# EAGLE design blinkm_mk2l (EAGLE 6.5.0)
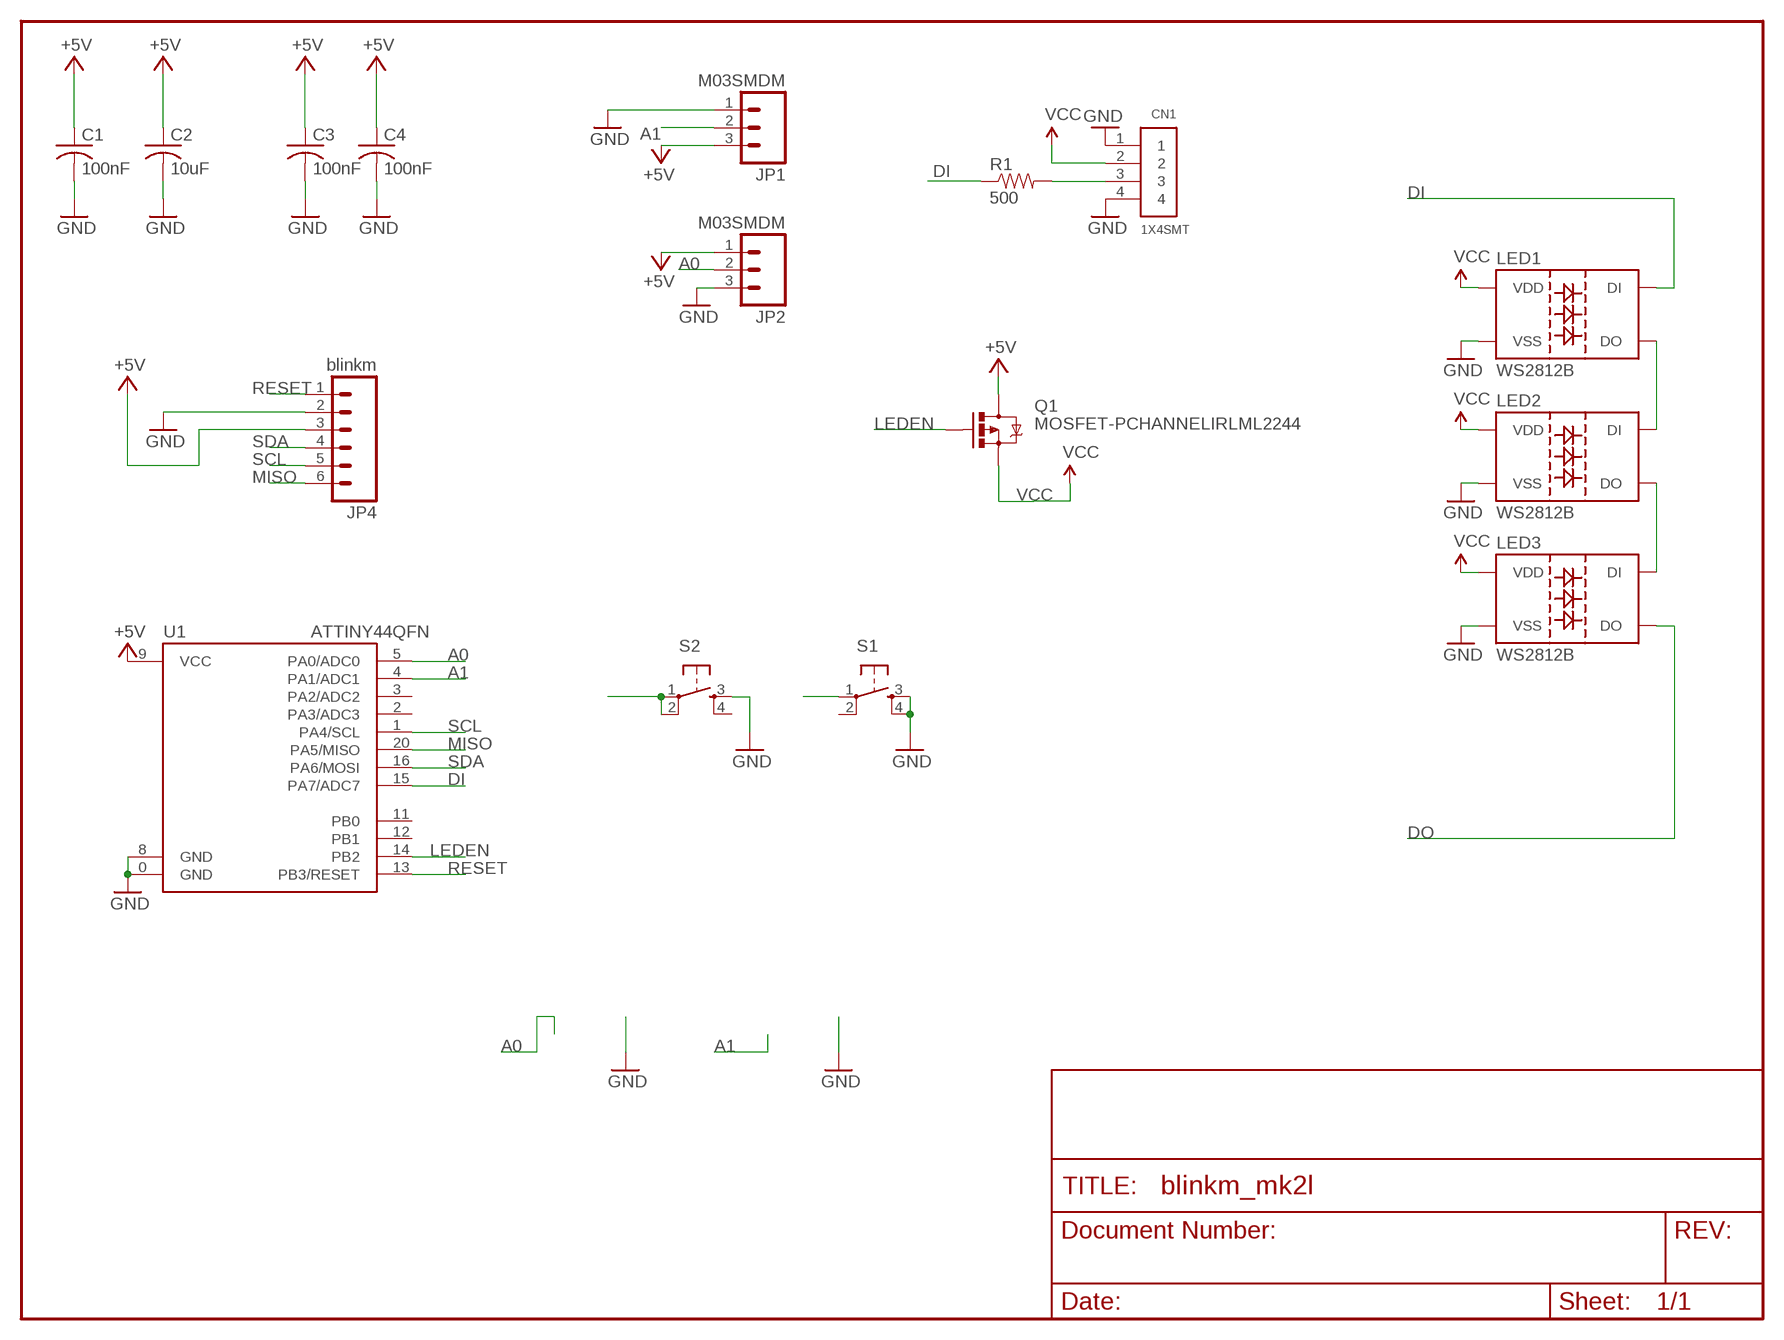
[diagram p0: schematic, sheet 1]

## Parts
C1  100nF  C-USC0603  [C0603]
C2  10uF  C-USC0603  [C0603]
C3  100nF  C-USC0603  [C0603]
C4  100nF  C-USC0603  [C0603]
CN1  1X4SMT  [1X4-SMT]
JP1  M03SMDM  [1X03-SMD-MINIMAL]
JP2  M03SMDM  [1X03-SMD-MINIMAL]
JP4  blinkm  M06LOCK  [1X06_LOCK]
LED1  WS2812B  [WS2812B]
LED2  WS2812B  [WS2812B]
LED3  WS2812B  [WS2812B]
Q1  MOSFET-PCHANNELIRLML2244  [SOT23-3]
R1  500  RESISTOR0603  [0603-RES]
S1  TAC_SWITCHSMD  [TACTILE_SWITCH_SMD]
S2  TAC_SWITCHSMD  [TACTILE_SWITCH_SMD]
U1  ATTINY44QFN  ATTINY24QFN  [QFN20]

## Nets
+5V: C1.1 C2.1 C3.1 C4.1 JP1.3 JP2.1 JP4.3 Q1.3(D) U1.9(VCC)
A0: JP2.2 S2.1 S2.2 U1.5(PA0/ADC0)
A1: JP1.2 S1.1 U1.4(PA1/ADC1)
DI: LED1.4(DI) R1.1 U1.15(PA7/ADC7)
DO: LED3.2(DO)
DOI1: LED1.2(DO) LED2.4(DI)
DOI2: LED2.2(DO) LED3.4(DI)
GND: C1.2 C2.2 C3.2 C4.2 CN1.1 CN1.4 JP1.1 JP2.3 JP4.2 LED1.3(VSS) LED2.3(VSS) LED3.3(VSS) S1.3 S1.4 S2.3 U1.0(GND) U1.8(GND)
LEDEN: Q1.1(G) U1.14(PB2)
MISO: JP4.6 U1.20(PA5/MISO)
N$1: CN1.3 R1.2
RESET: JP4.1 U1.13(PB3/RESET)
SCL: JP4.5 U1.1(PA4/SCL)
SDA: JP4.4 U1.16(PA6/MOSI)
VCC: CN1.2 LED1.1(VDD) LED2.1(VDD) LED3.1(VDD) Q1.2(S)
Unconnected: S1.2 S2.4 U1.2(PA3/ADC3) U1.3(PA2/ADC2) U1.11(PB0) U1.12(PB1)

## Library data of the parts
C1-C4 = rcl:C-US: CAPACITOR, American symbol
CN1 = adafruit:1X4: 4-pin connector
JP1 JP2 = todstuff:M03
JP4 = SparkFun-Connectors:M06: Header 6 Standard 6-pin 0.1" header. Use with straight break away headers (SKU : PRT-00116), right angle break away headers (PRT-00553), swiss pins (PRT-00743), machine pins (PRT-00117), and female headers (PRT-00115). Molex polarized connector foot print use with SKU : PRT-08094 with associated crimp pins and housings. NOTES ON THE VARIANTS LOCK and LOCK_LONGPADS... This footprint was designed to help hold the alignment of a through-hole component (i.e. 6-pin header) while soldering it into place. You may notice that each hole has been shifted either up or down by 0.005 of an inch from it's more standard position (which is a perfectly straight line). This slight alteration caused the pins (the squares in the middle) to touch the edges of the holes. Because they are alternating, it causes a "brace" to hold the component in place. 0.005 has proven to be the perfect amount of "off-center" position when using our standard breakaway headers. Although looks a little odd when you look at the bare footprint, once you have a header in there, the alteration is very hard to notice. Also, if you push a header all the way into place, it is covered up entirely on the bottom side. This idea of altering the position of holes to aid alignment will be further integrated into the Sparkfun Library for other footprints. It can help hold any component with 3 or more connection pins.
LED1-LED3 = WS2812:WS2812B
Q1 = SparkFun-DiscreteSemi:MOSFET-PCHANNEL: Generic PMOSFET; PROD_ID: TRANS-11153
R1 = SparkFun-Resistors:RESISTOR: Resistor Basic schematic elements and footprints for 0603, 1206, and PTH resistors.
S1 S2 = SparkFun-Electromechanical:TAC_SWITCH: Momentary Switch Button commonly used for reset or general input. Spark Fun Electronics SKU : COM-00097 SMT- SWCH-08247; PROD_ID: SWCH-08247
U1 = SparkFun-DigitalIC:ATTINY24: Atmel 20-pin 2kB flash uC

## Board
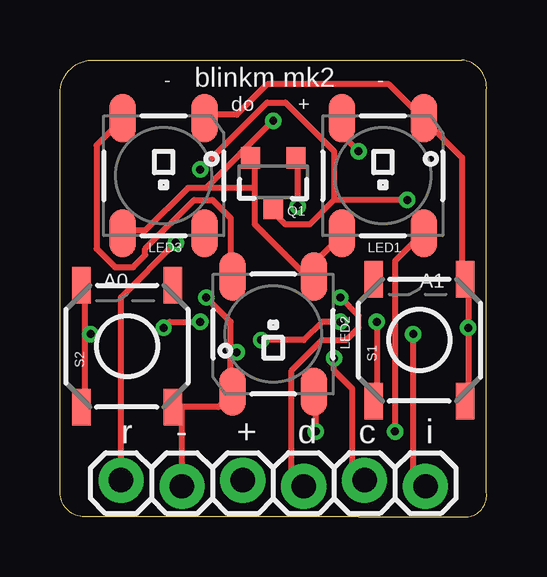
[diagram p1: board, top side]
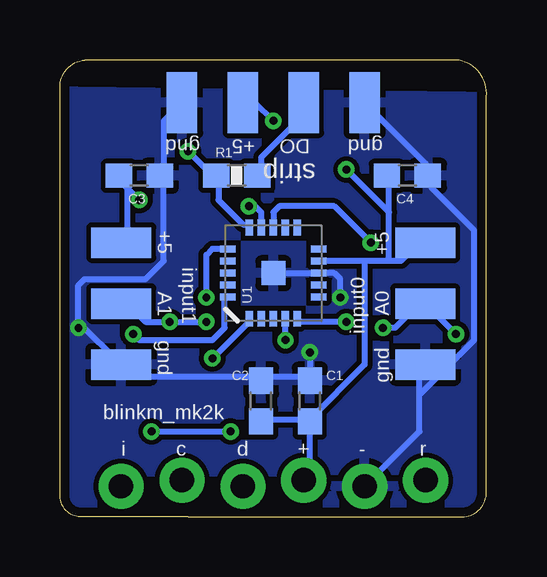
[diagram p2: board, bottom side, seen from below]

Size 17.79 x 19.05 mm. Coordinates in mm from the lower left corner, seen from the top.
Outline: 12.45,0 1.02,0 arc-90 0.01,1.02 0.01,17.53 arc-90 1.28,19.05 16.77,19.05 arc-90 17.79,17.78 17.79,1.02 arc-90 17.02,0 12.45,0
Copper layers (1*16): Top 0.0356mm / dielectric 1.5011mm / Bottom 0.0356mm
Design rules "LaenPCBOrder-tod *": minimum track width 10mil, minimum drill 13mil, track to track 8mil, track to pad 8mil, pad to pad 8mil, via to via 8mil, smd to smd 6mil, copper to edge 15mil, drill to drill 8mil, minimum pad ring 7mil, minimum via ring 7mil, stop-mask expansion 4mil, vias tented up to drill 25mil, thermal gap 10mil
vRestrict: area 7.9,9.1 to 9.9,11.2

### Footprints (pad centres in the part's own frame; a part is rotated, then mirrored left to right if it is on the bottom)
C0603 = smd 1.1 x 1: 1 -0.85,0; 2 0.85,0
1X4-SMT = smd 1.27 x 2.54: 1 -3.81,0; 2 -1.27,0; 3 1.27,0; 4 3.81,0
1X03-SMD-MINIMAL = smd 1.27 x 2.5: 1 -2.54,-0.01; 2 0,-0.01; 3 2.54,-0.01
1X06_LOCK = drill 1.016 pad 1.88: 1 0,0; 2 2.54,-0.254; 3 5.08,0; 4 7.62,-0.254; 5 10.16,0; 6 12.7,-0.254
WS2812B = smd 2 x 1.1: 1 2.4,-1.7; 2 2.4,1.7; 3 -2.4,1.7; 4 -2.4,-1.7
SOT23-3 = smd 0.8 x 0.9: 1 -0.95,-1; 2 0.95,-1; 3 0,1.1
0603-RES = smd 1.1 x 1: 1 -0.85,0; 2 0.85,0
TACTILE_SWITCH_SMD = smd 1.524 x 0.762: 1 -2.54,1.905; 2 2.54,1.905; 3 -2.54,-1.905; 4 2.54,-1.905
QFN20 = smd 1 x 1: 0 0,0 | smd 0.65 x 0.3: 1 -1.9,1; 2 -1.9,0.5; 3 -1.9,0; 4 -1.9,-0.5; 5 -1.9,-1; 11 1.9,-1; 12 1.9,-0.5; 13 1.9,0; 14 1.9,0.5; 15 1.9,1 | smd 0.3 x 0.65: 6 -1,-1.9; 7 -0.5,-1.9; 8 0,-1.9; 9 0.5,-1.9; 10 1,-1.9; 16 1,1.9; 17 0.5,1.9; 18 0,1.9; 19 -0.5,1.9; 20 -1,1.9

### Placement (x,y rotation side)
C1  7.37,4.83 90 bottom
C2  9.4,4.83 90 bottom
C3  14.48,14.22 0 bottom
C4  3.31,14.22 0 bottom
CN1  8.9,17.27 0 bottom
JP1  15.25,8.89 90 bottom
JP2  2.55,8.89 270 bottom
JP4  2.55,1.52 0 top
LED1  13.47,14.22 270 top
LED2  8.9,7.62 90 top
LED3  4.32,14.22 270 top
Q1  8.9,13.97 180 top
R1  10.42,14.22 0 bottom
S1  14.99,7.37 90 top
S2  2.8,7.11 90 top
U1  8.9,10.16 90 bottom

### Tracks (layer width: path | path; a pad name or v marks a point on that pad's centre or on a via)
+5V  (via drill 0.33)
  Top 0.254: 11.44,13.21 10.42,12.19 9.4,12.19 8.9,12.7 Q1.3 | v14.48,13.21 11.44,13.21 | 11.44,13.21 11.44,15.24 9.4,17.27 8.64,17.27 v5.85,14.48
  Bottom 0.254: 14.99,13.72 15.5,14.22 C3.1 | 14.99,13.72 v14.48,13.21 | 14.99,13.72 14.99,11.43 JP1.3 | 7.37,4.06 9.4,4.06 C2.1 | 7.37,4.06 C1.1 | JP4.3 7.37,1.78 7.37,3.81 C1.1 | 4.07,10.67 3.56,10.67 2.8,11.43 JP2.1 | 4.07,10.67 5.09,10.67 | 5.09,10.67 6.86,10.67 U1.9 | 4.07,10.67 4.07,12.7 | 4.07,12.7 4.07,14.22 C4.1 | 7.37,4.06 5.09,6.35 5.09,10.67 | 7.37,4.06 C1.1 | 4.07,12.7 v5.85,14.48
  pour Top: 23.12,18.03 23.12,-2.29 21.34,0 21.34,20.32
A0  (via drill 0.33)
  Top 0.254: 1.02,7.62 1.02,9.65 S2.2 | 1.02,7.62 1.02,4.57 S2.1 | v5.85,8.13 4.58,8.13 v4.32,7.87 | v1.28,7.62 1.02,7.62
  Bottom 0.254: v5.85,8.13 7.88,8.13 U1.5 | v4.32,7.87 3.82,7.87 2.8,8.89 JP2.2 v1.28,7.62
A1  (via drill 0.33)
  Top 0.254: v8.39,7.37 10.17,7.37 10.93,8.13 v11.69,8.13 | v13.21,8.13 13.21,4.83 S1.1
  Bottom 0.254: v8.39,7.37 8.39,8.13 U1.4 | v11.69,8.13 v13.21,8.13 14.23,8.13 14.99,8.89 JP1.2
DI  (via drill 0.33)
  Top 0.254: v12.45,15.24 11.94,15.75 11.94,16.51 LED1.4
  Bottom 0.254: U1.15 9.91,12.19 10.17,12.19 11.18,13.21 11.18,14.22 R1.1 11.44,14.22 v12.45,15.24
DOI1  (via drill 0.33)
  Top 0.254: v10.67,3.56 10.67,5.08 LED2.4 | v13.98,3.56 13.98,10.67 14.99,11.68 LED1.2
  Bottom 0.254: v13.98,3.56 v10.67,3.56
DOI2
  Top 0.254: LED2.2 7.12,10.16 7.12,12.45 6.36,13.21 5.59,13.21 3.56,11.18 3.56,10.92 3.05,10.41 2.29,10.41 1.53,11.18 1.53,15.49 2.55,16.51 LED3.4
GND  (via drill 0.33)
  Top 0.254: S1.3 17.02,4.83 v17.02,7.87 17.02,9.91 S1.4 16.77,9.91 16.77,14.99 15.25,16.51 LED1.3 14.99,16.76 13.72,18.03 8.64,18.03 7.37,16.76 6.1,16.76 LED3.3 | 5.09,4.57 6.61,4.57 7.12,5.08 LED2.3 7.12,5.33 7.12,6.86 | 5.09,4.57 4.83,4.57 S2.3 | v6.1,9.14 7.12,8.13 7.12,6.86 | JP4.2 5.09,4.57 | 7.12,6.86 v7.37,6.86
  Bottom 0.254: 13.47,14.22 13.47,16.51 CN1.1 | 13.47,14.22 C3.2 13.47,14.22 | 9.4,5.84 7.37,5.84 | 7.37,5.84 C1.2 7.37,5.84 | 9.4,5.84 C2.2 9.4,5.84 | 9.4,5.84 14.48,5.84 14.99,6.35 JP1.1 15.25,6.35 17.02,8.13 | 13.47,14.22 13.47,10.67 14.23,9.91 16.77,9.91 17.02,9.65 17.02,8.13 | v17.02,7.87 17.02,8.13 | U1.0 7.12,10.16 U1.8 6.86,10.16 6.36,10.16 6.1,9.91 v6.1,9.14 | CN1.4 2.55,14.73 2.55,14.22 C4.2 2.29,14.22 2.29,13.72 0.51,11.94 0.51,7.37 2.8,5.08 | 2.8,5.08 2.8,3.56 JP4.2 | 2.8,5.08 2.8,6.35 JP2.3 | v7.37,6.86 7.37,5.84
  pour Bottom: -0.76,17.53 -0.76,-1.27 20.33,-1.27 20.33,17.78
LEDEN  (via drill 0.33)
  Top 0.254: v9.91,12.95 9.91,14.73 Q1.1
  Bottom 0.254: v9.91,12.95 9.66,12.95 9.4,12.7 9.4,12.19 U1.14
MISO  (via drill 0.33)
  Top 0.254: v14.74,7.62 14.74,1.78 JP4.6
  Bottom 0.254: v14.74,7.62 14.48,7.37 11.44,7.37 10.93,7.87 10.93,9.14 U1.20
N$1
  Bottom 0.254: CN1.3 7.63,16.76 9.4,14.99 9.4,14.22 R1.2
RESET  (via drill 0.33)
  Top 0.254: v4.83,11.43 2.55,9.14 JP4.1
  Bottom 0.254: v4.83,11.43 6.36,12.95 8.64,12.95 8.9,12.7 8.9,12.19 U1.13
SCL  (via drill 0.33)
  Top 0.254: v11.44,6.6 11.44,6.1 12.2,5.33 12.2,2.03 JP4.5
  Bottom 0.254: v11.44,6.6 9.91,8.13 U1.1
SDA  (via drill 0.33)
  Top 0.254: v11.69,9.14 12.45,8.38 12.45,7.87 11.94,7.37 10.93,7.37 9.66,6.1 9.66,1.78 JP4.4
  Bottom 0.254: v11.69,9.14 11.69,10.92 11.44,11.18 10.93,11.18 U1.16
VCC  (via drill 0.33)
  Top 0.254: 8.13,13.72 8.13,12.19 10.17,10.16 | 8.13,13.72 8.13,14.73 Q1.2 | 10.17,10.16 10.42,9.91 LED2.1 10.17,10.16 | 8.13,13.72 6.1,13.72 | 6.1,13.72 5.34,13.72 3.56,11.94 2.8,11.94 LED3.1 | 10.17,10.16 11.69,11.68 LED1.1 | 6.1,13.72 v8.9,16.51
  Bottom 0.254: CN1.2 9.66,17.27 v8.9,16.51

### Text on the board
tPlace: - | blinkm mk2 | - | do | + | A0 | A1 | r | - | + | d | c | i
bPlace: gnd | DO | +5 | gnd | strip | +5 | +5 | input1 | A1 | A0 | input0 | gnd | gnd | blinkm_mk2k | r | - | + | d | c | i